# EAGLE design Group1_PCB_Layout (EAGLE 9.3.0)
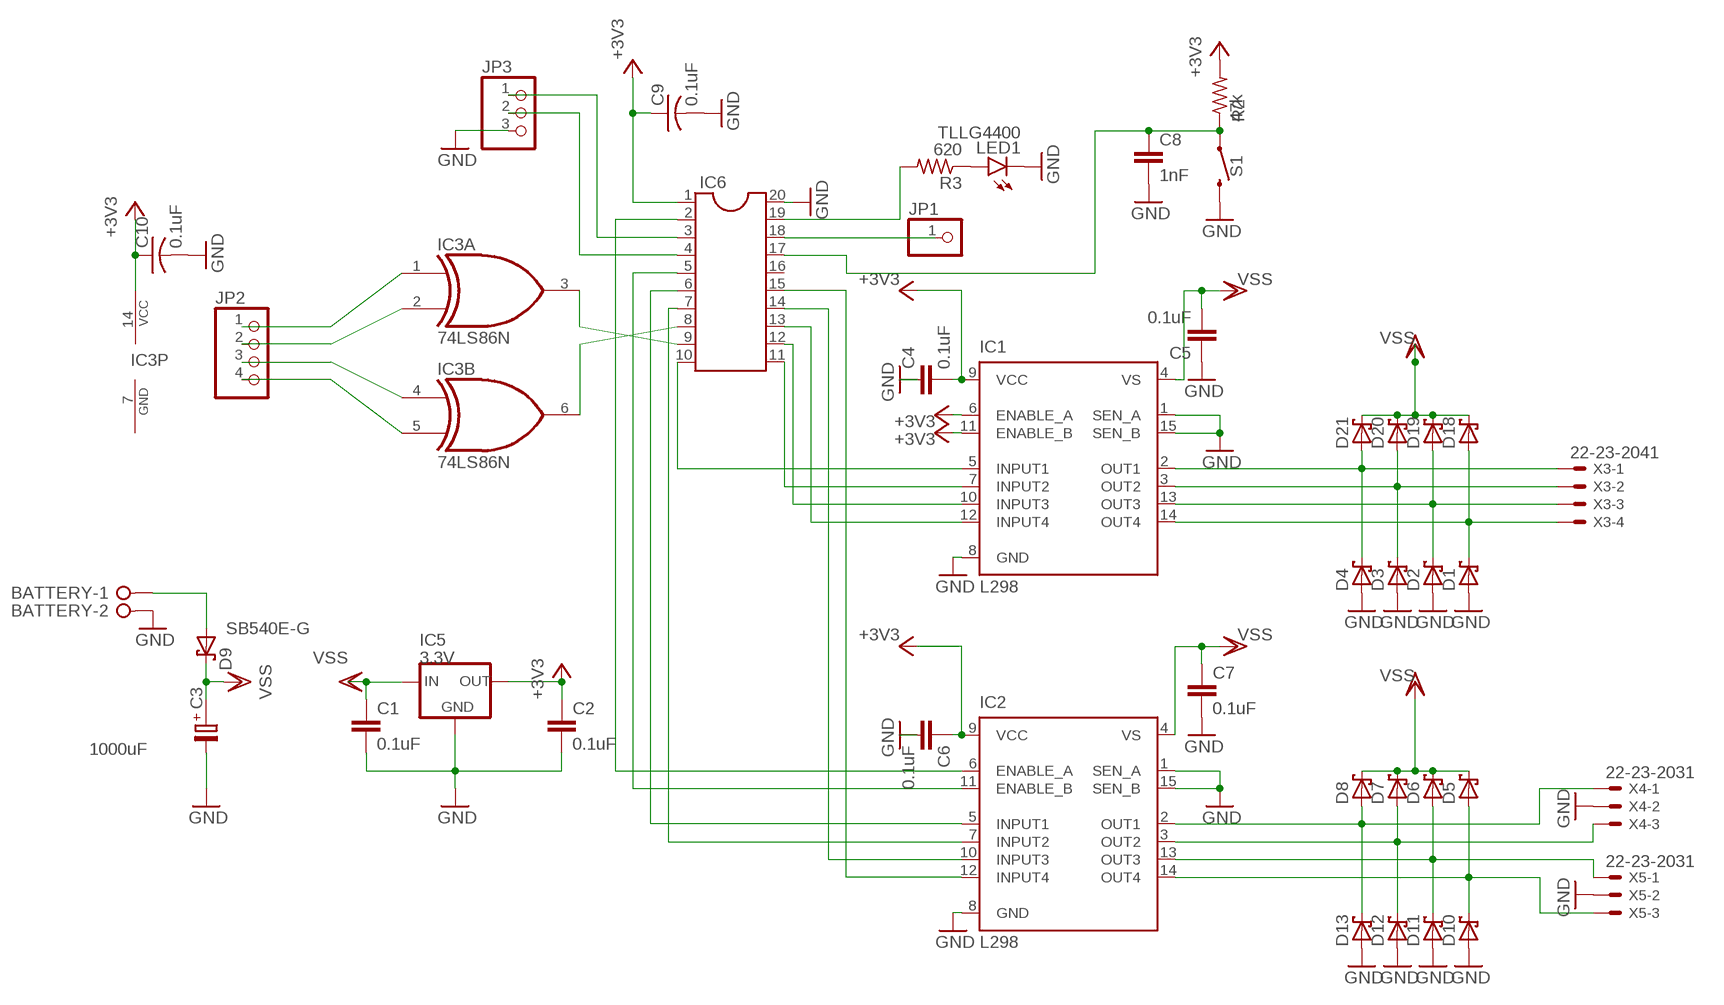
[diagram p0: schematic, sheet 1]

## Parts
BATTERY  W237-02P  [W237-132]
C1  0.1uF  C-EUC1206  [C1206]
C2  0.1uF  C-EUC1206  [C1206]
C3  1000uF  C-PR-5,0X10  [E5,0-10]
C4  0.1uF  C-EUC1206  [C1206]
C5  0.1uF  C-EUC1206  [C1206]
C6  0.1uF  C-EUC1206  [C1206]
C7  0.1uF  C-EUC1206  [C1206]
C8  1nF  C-EUC1206  [C1206]
C9  0.1uF  C-USC1206  [C1206]
C10  0.1uF  C-USC1206  [C1206]
D1  SCHOTTKY-DIODECB429-17  [CB429-17]
D2  SCHOTTKY-DIODECB429-17  [CB429-17]
D3  SCHOTTKY-DIODECB429-17  [CB429-17]
D4  SCHOTTKY-DIODECB429-17  [CB429-17]
D5  SCHOTTKY-DIODECB429-17  [CB429-17]
D6  SCHOTTKY-DIODECB429-17  [CB429-17]
D7  SCHOTTKY-DIODECB429-17  [CB429-17]
D8  SCHOTTKY-DIODECB429-17  [CB429-17]
D9  SB540E-G  SCHOTTKY-DIODEDO-201AD_UPRIGHT  [DO-201AD_UPRIGHT]
D10  SCHOTTKY-DIODECB429-17  [CB429-17]
D11  SCHOTTKY-DIODECB429-17  [CB429-17]
D12  SCHOTTKY-DIODECB429-17  [CB429-17]
D13  SCHOTTKY-DIODECB429-17  [CB429-17]
D18  SCHOTTKY-DIODECB429-17  [CB429-17]
D19  SCHOTTKY-DIODECB429-17  [CB429-17]
D20  SCHOTTKY-DIODECB429-17  [CB429-17]
D21  SCHOTTKY-DIODECB429-17  [CB429-17]
IC1  L298  [MULTIWATT-15]
IC2  L298  [MULTIWATT-15]
IC3  74LS86N  [DIL14]
IC5  3.3V  78LXX  [78LXX]
IC6  DIL20S  [SOCKET-20]
JP1  PINHD-1X1  [1X01]
JP2  PINHD-1X4  [1X04]
JP3  PINHD-1X3  [1X03]
LED1  TLLG4400  [LED3MM]
R2  47k  R-US_M1206  [M1206]
R3  620  R-US_R1206  [R1206]
S1  MOMENTARY-SWITCH-SPST-PTH-6.0MM  [TACTILE_SWITCH_PTH_6.0MM]
X3  22-23-2041  [22-23-2041]
X4  22-23-2031  [22-23-2031]
X5  22-23-2031  [22-23-2031]

## Nets
+3V3: C2.1 C4.2 C6.1 C9.1 C10.1 IC1.6(ENABLE_A) IC1.9(VCC) IC1.11(ENABLE_B) IC2.9(VCC) IC3.14(P:VCC) IC5.OUT IC6.1 R2.2
EN_A1: IC2.6(ENABLE_A) IC6.2
EN_B1: IC2.11(ENABLE_B) IC6.5
GND: BATTERY.2 C1.2 C2.2 C3.- C4.1 C5.1 C6.2 C7.2 C8.2 C9.2 C10.2 D1.A D2.A D3.A D4.A D10.A D11.A D12.A D13.A IC1.1(SEN_A) IC1.8(GND) IC1.15(SEN_B) IC2.1(SEN_A) IC2.8(GND) IC2.15(SEN_B) IC5.GND IC6.20 JP3.3 LED1.K(C) S1.3 X4.2 X5.2
N$1: D4.C D21.A IC1.2(OUT1) X3.1
N$2: D3.C D20.A IC1.3(OUT2) X3.2
N$3: D2.C D19.A IC1.13(OUT3) X3.3
N$4: D1.C D18.A IC1.14(OUT4) X3.4
N$5: IC1.5(INPUT1) IC6.10
N$6: IC1.7(INPUT2) IC6.11
N$7: LED1.A R3.1
N$8: IC1.10(INPUT3) IC6.12
N$9: IC6.18 JP1.1
N$10: IC6.19 R3.2
N$11: D8.A D13.C IC2.2(OUT1) X4.1
N$12: D7.A D12.C IC2.3(OUT2) X4.3
N$13: D6.A D11.C IC2.13(OUT3) X5.1
N$14: D5.A D10.C IC2.14(OUT4) X5.3
N$15: IC1.12(INPUT4) IC6.13
N$16: IC2.7(INPUT2) IC6.7
N$17: IC2.5(INPUT1) IC6.6
N$18: IC2.10(INPUT3) IC6.14
N$19: BATTERY.1 D9.1(A)
N$20: IC3.3(A:O) IC6.9
N$21: IC3.1(A:I0) JP2.1
N$22: IC3.2(A:I1) JP2.2
N$23: IC6.4 JP3.2
N$24: IC6.3 JP3.1
N$25: IC3.4(B:I0) JP2.3
N$26: IC2.12(INPUT4) IC6.15
N$27: IC3.5(B:I1) JP2.4
N$28: IC3.6(B:O) IC6.8
N$29: C8.1 IC6.17 R2.1 S1.1
VSS: C1.1 C3.+ C5.2 C7.1 D5.C D6.C D7.C D8.C D9.2(C) D18.C D19.C D20.C D21.C IC1.4(VS) IC2.4(VS) IC5.IN
Unconnected: IC3.8(C:O) IC3.9(C:I0) IC3.10(C:I1) IC3.11(D:O) IC3.12(D:I0) IC3.13(D:I1) IC6.16

## Power pins joined to a net without a drawn wire
GND: IC3.7(P:GND)

## Library data of the parts
BATTERY = con-wago-508:W237-02P: WAGO SREW CLAMP; OC_FARNELL: unknown; OC_NEWARK: unknown
C1 C2 C4-C8 = rcl:C-EU: CAPACITOR, European symbol; SPICEPREFIX: C
C3 = cap-pan40:C-PR: POLARIZED ELECTROLYTIC/TANTALUM
C9 C10 = adafruit:C-US: CAPACITOR, American symbol
D1-D8 D10-D13 D18-D21 = adafruit:SCHOTTKY-DIODE: Schottky Diode
D9 = diode:SCHOTTKY-DIODE: Schottky Diode
IC1 IC2 = st-microelectronics:L298: DUAL FULL-BRIDGE DRIVER
IC3 = 74xx-us:74*86: Quad 2-input EXCLUSIV-OR (XOR) gate; SPICEPREFIX: I
IC5 = v-reg:78LXX: VOLTAGE REGULATOR
IC6 = ic-package:DIL20: Dual In Line / Socket
JP1 = pinhead:PINHD-1X1: PIN HEADER
JP2 = pinhead:PINHD-1X4: PIN HEADER
JP3 = pinhead:PINHD-1X3: PIN HEADER
LED1 = led:TLLG4400: Low Current (2mA) LED 3 mm Tinted Diffused Package color GREEN Source: Data sheet <http://www.farnell.com/datasheets/391098.pdf>; MF: VISHAY SEMICONDUCTOR; OC_FARNELL: 1612435
R2 R3 = adafruit:R-US_: RESISTOR, American symbol
S1 = SparkFun-Switches:MOMENTARY-SWITCH-SPST: Momentary Switch (Pushbutton) - SPST Normally-open (NO) SPST momentary switches (buttons, pushbuttons). Variants PTH-12MM - 12mm square, through-hole Momentary Pushbutton Switch - 12mm Square <https://www.sparkfun.com/products/9190> (COM-09190) PTH-6.0MM, PTH-6.0MM-KIT - 6.0mm square, through-hole Mini Pushbutton Switch <https://www.sparkfun.com/products/97> (COM-00097) KIT package intended for soldering kit's - only one side of pads' copper is exposed. PTH-RIGHT-ANGLE-KIT - Right-angle, through-hole Right Angle Tactile Button <https://www.sparkfun.com/products/10791> - Used on SparkFun BigTime Watch Kit <https://www.sparkfun.com/products/11734> SMD-12MM - 12mm square, surface-mount Tactile Button - SMD (12mm) <https://www.sparkfun.com/products/12993> (COM-12993) Used on SparkFun PicoBoard <https://www.sparkfun.com/products/11888> SMD-4.5MM - 4.5mm Square Trackball Switch Used on SparkFun Blackberry Trackballer Breakout <https://www.sparkfun.com/products/13169> SMD-4.6MMX2.8MM - 4.60mm x 2.80mm, surface mount Used on SparkFun SAMD21 Mini Breakout <https://www.sparkfun.com/products/13664> SMD-5.2MM, SMD-5.2-REDUNDANT - 5.2mm square, surface-mount Mini Pushbutton Switch - SMD <https://www.sparkfun.com/products/8720> (COM-08720) Used on Arduino Pro Mini <https://www.sparkfun.com/products/11114> REDUNDANT package connects both switch circuits together SMD-6.0X3.5MM - 6.0 x 3.5mm, surface mount Momentary Reset Switch SMD <https://www.sparkfun.com/products/8229> (COM-08229) SMD-6.2MM-TALL - 6.2mm square, surface mount Tactile Button - SMD (6mm) <https://www.sparkfun.com/products/12992> Used on SparkFun Digital Sandbox <https://www.sparkfun.com/products/12651> SMD-RIGHT-ANGLE - Right-angle, surface mount Used on SparkFun Block for Intel® Edison - Arduino <https://www.sparkfun.com/products/13036>; PROD_ID: SWCH-08441; SF_SKU: COM-00097
X3 = con-molex:22-23-2041: .100" (2.54mm) Center Header - 4 Pin; MF: MOLEX; MPN: 22-23-2041; OC_FARNELL: 1462920; OC_NEWARK: 38C0355
X4 X5 = con-molex:22-23-2031: .100" (2.54mm) Center Header - 3 Pin; MF: MOLEX; MPN: 22-23-2031; OC_FARNELL: 1462950; OC_NEWARK: 30C0862

## Board
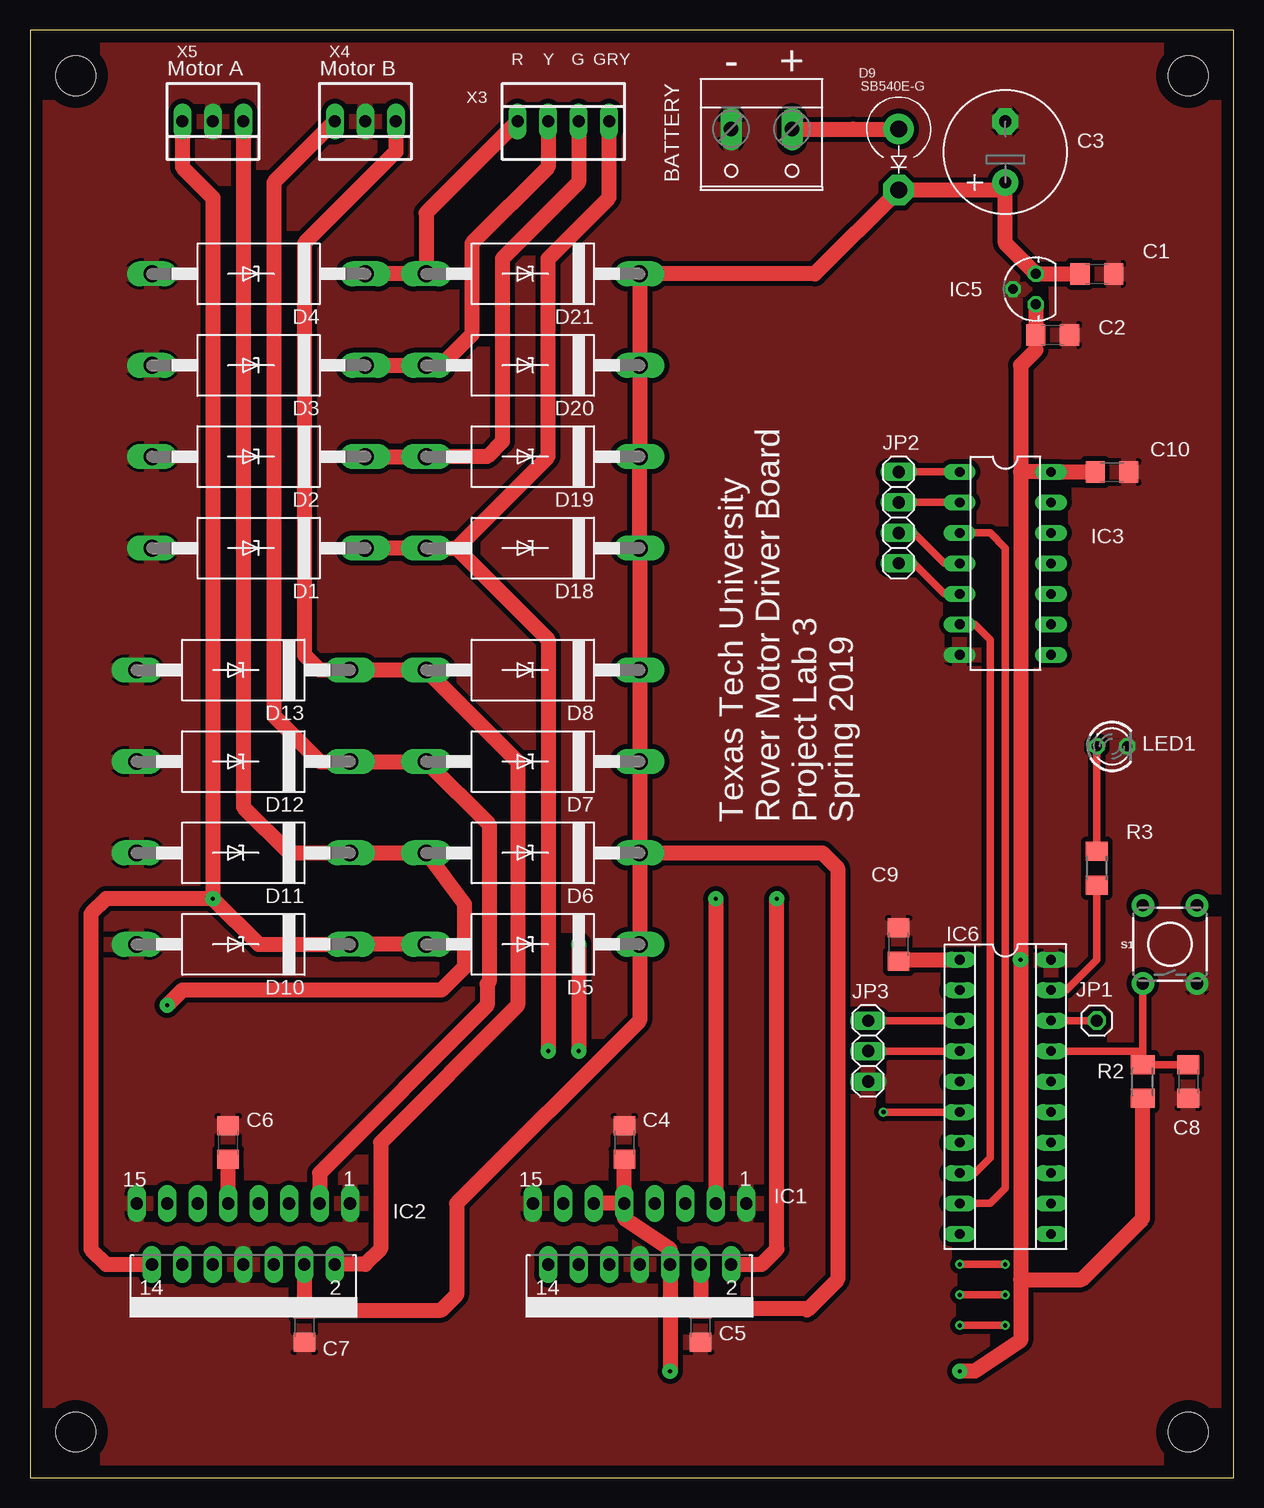
[diagram p1: board, top side]
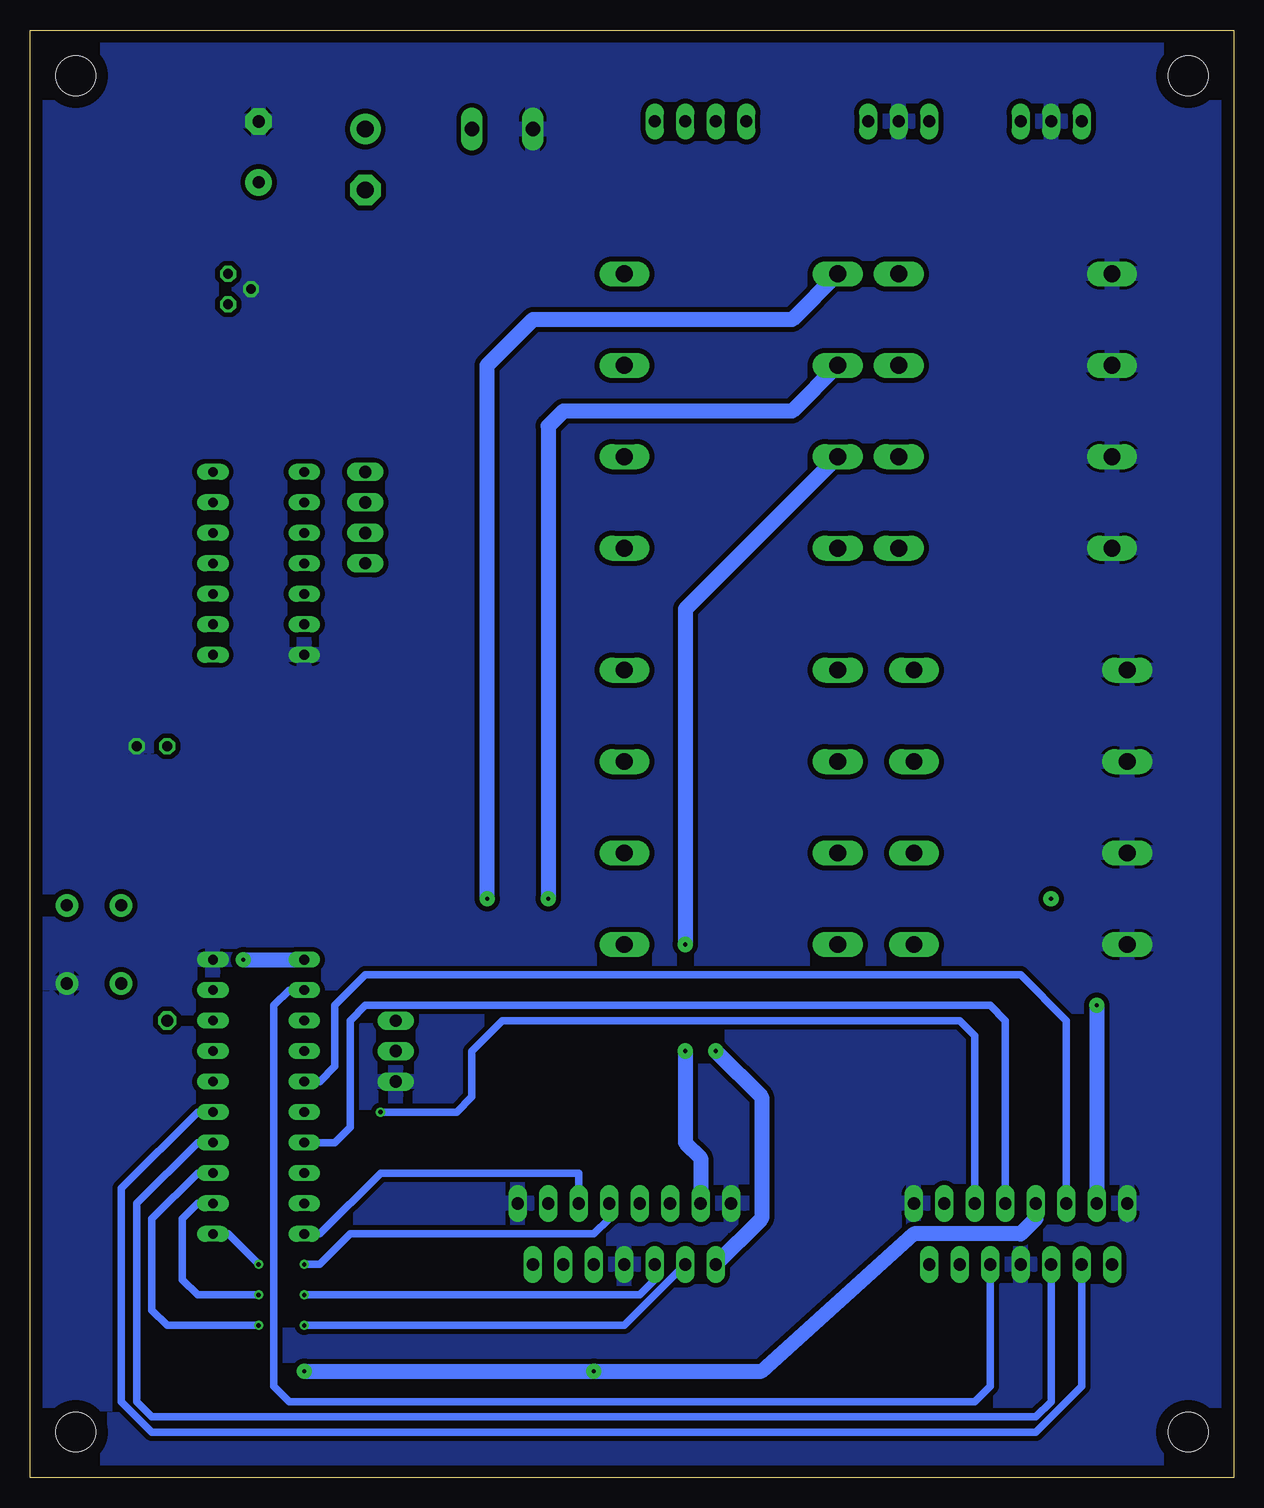
[diagram p2: board, bottom side, seen from below]

Size 100.33 x 120.65 mm. Coordinates in mm from the lower left corner, seen from the top.
Outline: 0,0 100.33,0 100.33,120.65 0,120.65 0,0
Copper layers (1*16): Top 0.035mm / dielectric 1.5mm / Bottom 0.035mm
Design rules "default *": minimum track width 25mil, minimum drill 0.35mm, track to track 6mil, track to pad 6mil, pad to pad 6mil, via to via 6mil, smd to smd 6mil, copper to edge 40mil, drill to drill 6mil, minimum pad ring 10mil, minimum via ring 8mil, stop-mask expansion 4mil, vias tented up to drill 0mil, thermal gap 10mil
Holes 3.3 mm at 3.81,3.81 96.52,3.81 96.52,116.84 3.81,116.84

### Footprints (pad centres in the part's own frame; a part is rotated, then mirrored left to right if it is on the bottom)
W237-132 = drill 1.194 long: 1 -2.54,-0.635; 2 2.54,-0.635
C1206 = smd 1.6 x 1.8: 1 -1.4,0; 2 1.4,0
E5,0-10 = drill 1.016 pad 2.184: + -2.54,0 | drill 1.016 pad 2.184 octagon: - 2.54,0
CB429-17 = drill 1.397 long: A 8.89,0; C -8.89,0
DO-201AD_UPRIGHT = drill 1.4 pad 2.54: 1 0,0 | drill 1.4 pad 2.54 octagon: 2 0,-5.08
MULTIWATT-15 = drill 1.016 long: 1 -8.89,-7.62; 2 -7.62,-2.54; 3 -6.35,-7.62; 4 -5.08,-2.54; 5 -3.81,-7.62; 6 -2.54,-2.54; 7 -1.27,-7.62; 8 0,-2.54; 9 1.27,-7.62; 10 2.54,-2.54; 11 3.81,-7.62; 12 5.08,-2.54; 13 6.35,-7.62; 14 7.62,-2.54; 15 8.89,-7.62
DIL14 = drill 0.813 long: 1 -7.62,-3.81; 2 -5.08,-3.81; 3 -2.54,-3.81; 4 0,-3.81; 5 2.54,-3.81; 6 5.08,-3.81; 7 7.62,-3.81; 8 7.62,3.81; 9 5.08,3.81; 10 2.54,3.81; 11 0,3.81; 12 -2.54,3.81; 13 -5.08,3.81; 14 -7.62,3.81
78LXX = drill 0.813 octagon: GND 0,1.905; IN 1.27,0; OUT -1.27,0
SOCKET-20 = drill 0.813 long: 1 -11.43,-3.81; 2 -8.89,-3.81; 3 -6.35,-3.81; 4 -3.81,-3.81; 5 -1.27,-3.81; 6 1.27,-3.81; 7 3.81,-3.81; 8 6.35,-3.81; 9 8.89,-3.81; 10 11.43,-3.81; 11 11.43,3.81; 12 8.89,3.81; 13 6.35,3.81; 14 3.81,3.81; 15 1.27,3.81; 16 -1.27,3.81; 17 -3.81,3.81; 18 -6.35,3.81; 19 -8.89,3.81; 20 -11.43,3.81
1X01 = drill 1.016 octagon: 1 0,0
1X04 = drill 1.016 long: 1 -3.81,0; 2 -1.27,0; 3 1.27,0; 4 3.81,0
1X03 = drill 1.016 long: 1 -2.54,0; 2 0,0; 3 2.54,0
LED3MM = drill 0.813 octagon: A -1.27,0; K 1.27,0
M1206 = smd 1.6 x 2: 1 -1.4,0; 2 1.4,0
R1206 = smd 1.6 x 1.803: 1 -1.422,0; 2 1.422,0
TACTILE_SWITCH_PTH_6.0MM = drill 1.016 pad 1.88: 1 -3.251,2.261; 2 3.251,2.261; 3 -3.251,-2.261; 4 3.251,-2.261
22-23-2041 = drill 1 long: 1 -3.81,0; 2 -1.27,0; 3 1.27,0; 4 3.81,0
22-23-2031 = drill 1 long: 1 -2.54,0; 2 0,0; 3 2.54,0

### Placement (x,y rotation side)
BATTERY  60.96,111.76 180 top
C1  88.9,100.33 0 top
C2  85.22,95.25 0 top
C3  81.28,110.49 90 top
C4  49.53,27.94 270 top
C5  55.88,12.7 90 top
C6  16.51,27.94 90 top
C7  22.86,12.7 270 top
C8  96.52,33.02 270 top
C9  72.39,44.45 90 top
C10  90.17,83.82 0 top
D1  19.05,77.47 180 top
D2  19.05,85.09 180 top
D3  19.05,92.71 180 top
D4  19.05,100.33 180 top
D5  41.91,44.45 180 top
D6  41.91,52.07 180 top
D7  41.91,59.69 180 top
D8  41.91,67.31 180 top
D9  72.39,112.39 0 top
D10  17.78,44.45 180 top
D11  17.78,52.07 180 top
D12  17.78,59.69 180 top
D13  17.78,67.31 180 top
D18  41.91,77.47 180 top
D19  41.91,85.09 180 top
D20  41.91,92.71 180 top
D21  41.91,100.33 180 top
IC1  50.8,15.24 180 top
IC2  17.78,15.24 180 top
IC3  81.28,76.2 270 top
IC5  83.82,99.06 90 top
IC6  81.28,31.75 270 top
JP1  88.9,38.1 180 top
JP2  72.39,80.01 270 top
JP3  69.85,35.56 270 top
LED1  90.17,60.96 0 top
R2  92.71,33.02 270 top
R3  88.9,50.8 270 top
S1  95,44.45 90 top
X3  44.45,113.03 0 top
X4  27.94,113.03 180 top
X5  15.24,113.03 180 top

### Tracks (layer width: path | path; a pad name or v marks a point on that pad's centre or on a via)
+3V3  (via drill 0.35 pad 1.27)
  Top 0.635: 82.55,92.71 | C2.1 83.82,93.98
  Top 1.27: 82.55,92.71 82.55,83.82 | IC1.9 IC1.11 | IC1.9 C4.2 | IC2.9 C6.1 | IC5.OUT C2.1 | 83.82,93.98 82.55,92.71 | 82.55,83.82 IC3.14 C10.1 | 82.55,83.82 v82.55,43.18 82.55,16.51 | 82.55,16.51 87.63,16.51 92.71,21.59 R2.2 | 82.55,16.51 82.55,11.43 78.74,8.89 v77.47,8.89 | v53.34,8.89 IC1.6 53.34,19.05 49.53,21.59 IC1.9 | IC6.1 72.42,43.18 C9.1
  Bottom 0.635: IC2.9 16.51,21.59
  Bottom 1.27: 16.51,21.59 17.78,20.32 26.67,20.32 39.37,8.89 v53.34,8.89 v77.47,8.89 | v82.55,43.18 IC6.1
EN_A1
  Bottom 0.635: IC6.2 78.74,40.64 80.01,39.37 80.01,7.62 78.74,6.35 21.59,6.35 20.32,7.62 IC2.6
EN_B1
  Bottom 0.635: IC2.11 13.97,38.1 17.78,41.91 72.39,41.91 74.93,39.37 74.93,34.29 76.2,33.02 IC6.5
GND
  Bottom 0.635: IC2.15 8.89,21.59
  pour Top (isolate 0.406): -10.16,129.54 105.41,129.54 105.41,-11.43 -10.16,-11.43
  pour Bottom (isolate 0.406): -10.16,129.54 105.41,129.54 105.41,-11.43 -10.16,-11.43
N$1  (via drill 0.35 pad 1.27)
  Top 1.27: X3.1 33.02,105.41 D21.A D4.C | IC1.2 60.96,17.78 62.23,19.05 v62.23,48.26
  Bottom 1.27: D21.A 36.83,96.52 58.42,96.52 62.23,92.71 v62.23,48.26
N$2  (via drill 0.35 pad 1.27)
  Top 1.27: v57.15,48.26 IC1.3 | X3.2 43.18,109.22 36.83,102.87 36.83,95.25 34.29,92.71 D20.A D3.C
  Bottom 1.27: D20.A 36.83,88.9 55.88,88.9 57.15,87.63 v57.15,48.26
N$3  (via drill 0.35 pad 1.27)
  Top 1.27: v45.72,44.45 v45.72,35.56 | X3.3 45.72,107.95 39.37,101.6 39.37,86.36 38.1,85.09 D19.A D2.C
  Bottom 1.27: D19.A 45.72,72.39 v45.72,44.45 | IC1.13 44.45,26.67 45.72,27.94 v45.72,35.56
N$4  (via drill 0.35 pad 1.27)
  Top 1.27: v43.18,35.56 43.18,69.85 35.56,77.47 | 35.56,77.47 D18.A D1.C | 35.56,77.47 43.18,85.09 43.18,101.6 48.26,106.68 X3.4
  Bottom 1.27: IC1.14 39.37,21.59 39.37,31.75 v43.18,35.56
N$5
  Bottom 0.635: IC1.5 54.61,25.4 71.12,25.4 76.2,20.32 IC6.10
N$6  (via drill 0.35, 0.35 pad 0.64)
  Top 0.635: v81.28,17.78 v77.47,17.78
  Bottom 0.635: IC1.7 52.07,21.59 53.34,20.32 73.66,20.32 76.2,17.78 v77.47,17.78 | v81.28,17.78 83.82,20.32 IC6.11
N$7
  Top 0.635: R3.1 LED1.A
N$8  (via drill 0.35)
  Top 0.635: v81.28,15.24 v77.47,15.24
  Bottom 0.635: IC1.10 48.26,16.51 49.53,15.24 v77.47,15.24 | v81.28,15.24 86.36,15.24 87.63,16.51 87.63,21.59 86.36,22.86 IC6.12
N$9
  Top 0.635: JP1.1 IC6.18
N$10
  Top 0.635: IC6.19 86.36,40.64 88.9,43.18 R3.2
N$11
  Top 1.27: X4.1 30.48,110.49 22.86,102.87 22.86,68.58 24.13,67.31 D13.C D8.A 40.64,59.69 40.64,39.37 29.21,27.94 29.21,19.05 27.94,17.78 IC2.2
N$12
  Top 1.27: X4.3 20.32,107.95 20.32,63.5 24.13,59.69 D12.C D7.A 38.25,54.46 38.25,41.32 38.1,41.17 38.1,39.37 24.13,25.4 IC2.3
N$13  (via drill 0.35 pad 1.27)
  Top 1.27: X5.1 17.78,55.88 21.59,52.07 D11.C D6.A 36.2,47.84 36.2,42.55 34.29,40.64 12.7,40.64 v11.43,39.37
  Bottom 1.27: v11.43,39.37 IC2.13
N$14  (via drill 0.35 pad 1.27)
  Top 1.27: X5.3 12.7,109.22 15.24,106.68 v15.24,48.26 | v15.24,48.26 19.05,44.45 D10.C D5.A | v15.24,48.26 6.35,48.26 5.08,46.99 5.08,19.05 6.35,17.78 IC2.14
N$15  (via drill 0.35)
  Top 0.635: v81.28,12.7 v77.47,12.7
  Bottom 0.635: IC1.12 50.8,12.7 v77.47,12.7 | IC6.13 86.36,25.4 90.17,21.59 90.17,13.97 88.9,12.7 v81.28,12.7
N$16
  Bottom 0.635: IC6.7 74.93,27.94 73.66,29.21 73.66,38.1 72.39,39.37 20.32,39.37 19.05,38.1 IC2.7
N$17  (via drill 0.35)
  Top 0.635: IC6.6 v71.12,30.48
  Bottom 0.635: IC2.5 21.59,36.83 22.86,38.1 49.53,38.1 60.96,38.1 63.5,35.56 63.5,31.75 64.77,30.48 v71.12,30.48
N$18
  Bottom 0.635: IC2.10 15.24,6.35 16.51,5.08 90.17,5.08 91.44,6.35 91.44,22.86 86.36,27.94 IC6.14
N$19
  Top 1.27: BATTERY.1 68.58,112.39 D9.1
N$20
  Top 0.635: IC6.9 80.01,22.86 81.28,24.13 81.28,77.47 80.01,78.74 IC3.3
N$21
  Top 0.635: JP2.1 IC3.1
N$22
  Top 0.635: IC3.2 JP2.2
N$23
  Top 0.635: IC6.4 JP3.2
N$24
  Top 0.635: IC6.3 JP3.1
N$25
  Top 0.635: JP2.3 73.66,78.74 76.2,76.2 IC3.4
N$26
  Bottom 0.635: IC6.15 86.36,30.48 92.71,24.13 92.71,6.35 90.17,3.81 16.51,3.81 12.7,7.62 IC2.12
N$27
  Top 0.635: JP2.4 73.66,76.2 76.2,73.66 IC3.5
N$28
  Top 0.635: IC6.8 78.74,25.4 80.01,26.67 80.01,69.85 78.74,71.12 IC3.6
N$29
  Top 0.635: 92.71,35.56 92.71,41.16 S1.1 | 92.71,35.56 R2.1 C8.1 | 92.71,35.56 IC6.17
VSS
  Top 1.27: D6.C D7.C D8.C D18.C D19.C D20.C D21.C 65.41,100.33 D9.2 80.64,107.31 C3.+ 81.28,102.87 IC5.IN C1.1 | D6.C D5.C 50.8,38.1 35.56,22.86 35.56,15.24 34.29,13.97 22.99,13.97 C7.1 IC2.4 | D6.C 66.04,52.07 67.31,50.8 67.31,16.51 64.77,13.97 64.64,14.1 C5.2 IC1.4

### Text on the board
tNames: R | Y | G | GRY | - | + | Motor A | Motor B | Texas Tech University / Rover Motor Driver Board / Project Lab 3 / Spring 2019